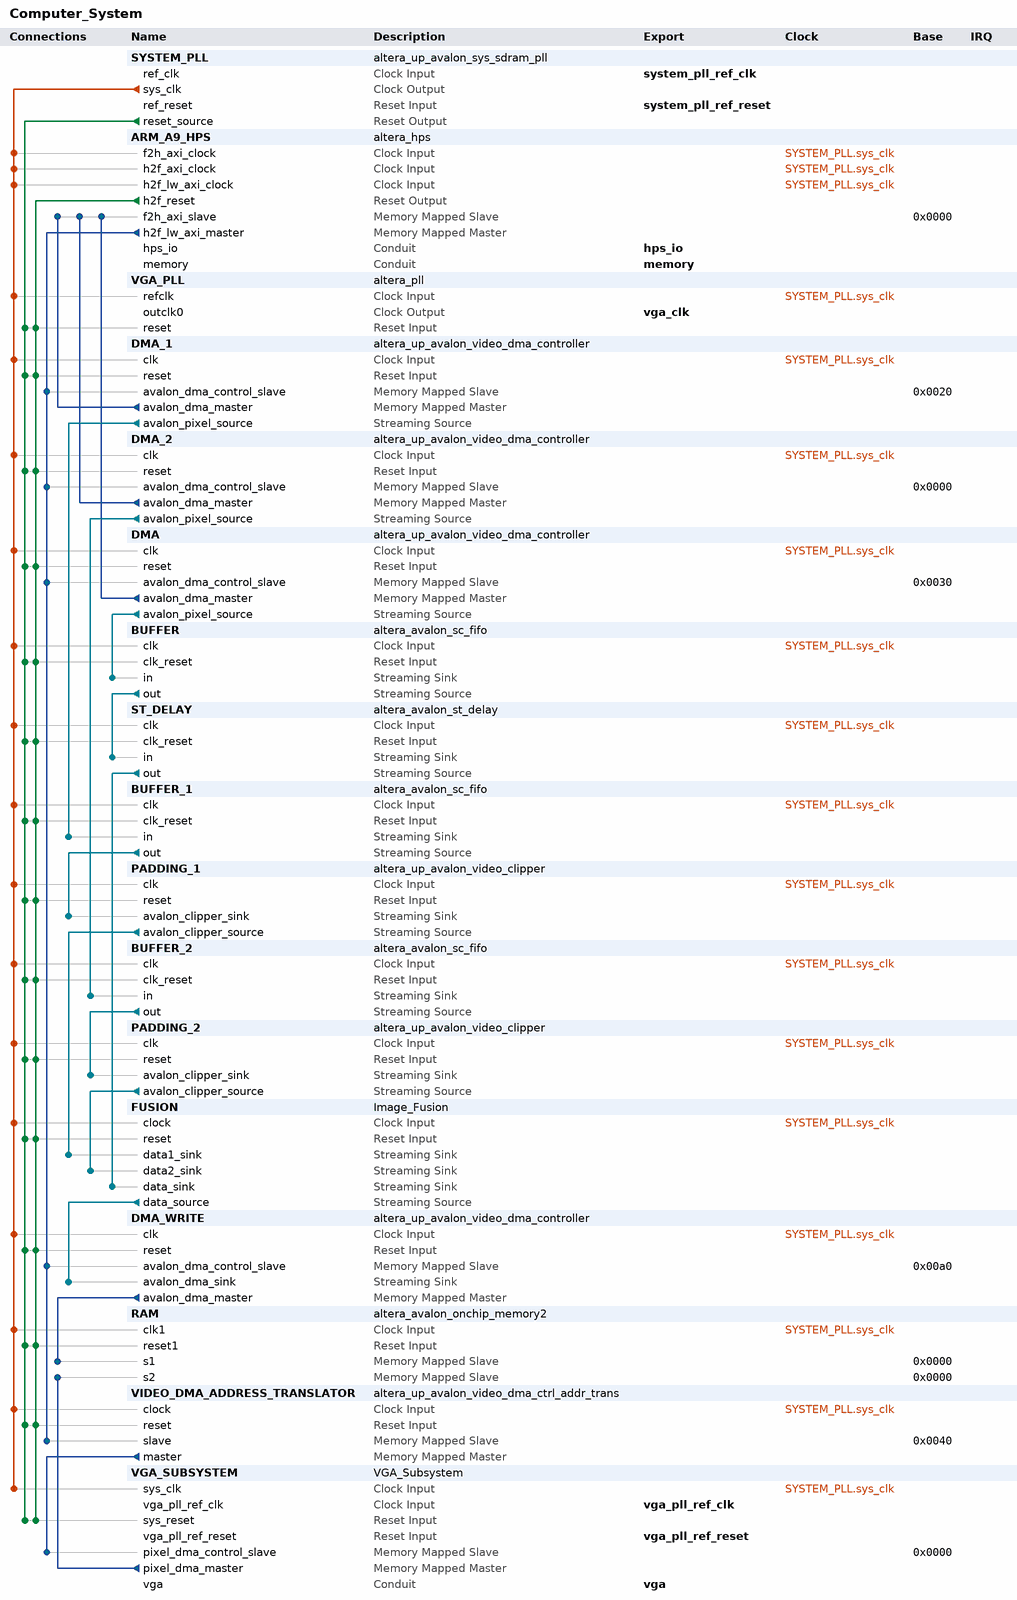
[diagram p0: system contents]
# Platform Designer (Qsys) system Computer_System, Cyclone V 5CSEMA5F31C6
# Parameters at their usual value, and those the tool derives, are not listed.
package require -exact qsys 17.1
create_system Computer_System
set_project_property DEVICE_FAMILY {Cyclone V}
set_project_property DEVICE 5CSEMA5F31C6

add_instance SYSTEM_PLL altera_up_avalon_sys_sdram_pll 17.1
set_instance_parameter_value SYSTEM_PLL CV_boards DE1-SoC
set_instance_parameter_value SYSTEM_PLL gui_outclk 100.0
set_instance_parameter_value SYSTEM_PLL gui_refclk 50.0

add_instance ARM_A9_HPS altera_hps 17.1
set_instance_parameter_value ARM_A9_HPS EMAC1_Mode RGMII
set_instance_parameter_value ARM_A9_HPS EMAC1_PinMuxing {HPS I/O Set 0}
set_instance_parameter_value ARM_A9_HPS F2SCLK_COLDRST_Enable false
set_instance_parameter_value ARM_A9_HPS F2SCLK_DBGRST_Enable false
set_instance_parameter_value ARM_A9_HPS F2SCLK_WARMRST_Enable false
set_instance_parameter_value ARM_A9_HPS F2SINTERRUPT_Enable true
set_instance_parameter_value ARM_A9_HPS F2S_Width 2
set_instance_parameter_value ARM_A9_HPS FPGA_PERIPHERAL_OUTPUT_CLOCK_FREQ_EMAC0_GTX_CLK 125
set_instance_parameter_value ARM_A9_HPS FPGA_PERIPHERAL_OUTPUT_CLOCK_FREQ_EMAC0_MD_CLK 2.5
set_instance_parameter_value ARM_A9_HPS FPGA_PERIPHERAL_OUTPUT_CLOCK_FREQ_EMAC1_GTX_CLK 125
set_instance_parameter_value ARM_A9_HPS FPGA_PERIPHERAL_OUTPUT_CLOCK_FREQ_EMAC1_MD_CLK 2.5
set_instance_parameter_value ARM_A9_HPS HPS_PROTOCOL DDR3
set_instance_parameter_value ARM_A9_HPS I2C0_Mode I2C
set_instance_parameter_value ARM_A9_HPS I2C0_PinMuxing {HPS I/O Set 0}
set_instance_parameter_value ARM_A9_HPS I2C1_Mode I2C
set_instance_parameter_value ARM_A9_HPS I2C1_PinMuxing {HPS I/O Set 0}
set_instance_parameter_value ARM_A9_HPS LWH2F_Enable true
set_instance_parameter_value ARM_A9_HPS MEM_BANKADDR_WIDTH 3
set_instance_parameter_value ARM_A9_HPS MEM_CLK_FREQ 400.0
set_instance_parameter_value ARM_A9_HPS MEM_COL_ADDR_WIDTH 10
set_instance_parameter_value ARM_A9_HPS MEM_DQ_WIDTH 32
set_instance_parameter_value ARM_A9_HPS MEM_DRV_STR RZQ/7
set_instance_parameter_value ARM_A9_HPS MEM_ROW_ADDR_WIDTH 15
set_instance_parameter_value ARM_A9_HPS MEM_RTT_NOM RZQ/4
set_instance_parameter_value ARM_A9_HPS MEM_RTT_WR RZQ/4
set_instance_parameter_value ARM_A9_HPS MEM_TCL 11
set_instance_parameter_value ARM_A9_HPS MEM_TFAW_NS 30.0
set_instance_parameter_value ARM_A9_HPS MEM_TRAS_NS 35.0
set_instance_parameter_value ARM_A9_HPS MEM_TRCD_NS 13.75
set_instance_parameter_value ARM_A9_HPS MEM_TRFC_NS 260.0
set_instance_parameter_value ARM_A9_HPS MEM_TRP_NS 13.75
set_instance_parameter_value ARM_A9_HPS MEM_VENDOR JEDEC
set_instance_parameter_value ARM_A9_HPS MEM_WTCL 8
set_instance_parameter_value ARM_A9_HPS QSPI_Mode {1 SS}
set_instance_parameter_value ARM_A9_HPS QSPI_PinMuxing {HPS I/O Set 0}
set_instance_parameter_value ARM_A9_HPS REF_CLK_FREQ 25.0
set_instance_parameter_value ARM_A9_HPS S2FCLK_USER2CLK 5
set_instance_parameter_value ARM_A9_HPS S2F_Width 3
set_instance_parameter_value ARM_A9_HPS SDIO_Mode {4-bit Data}
set_instance_parameter_value ARM_A9_HPS SDIO_PinMuxing {HPS I/O Set 0}
set_instance_parameter_value ARM_A9_HPS SPIM1_Mode {Single Slave Select}
set_instance_parameter_value ARM_A9_HPS SPIM1_PinMuxing {HPS I/O Set 0}
set_instance_parameter_value ARM_A9_HPS STM_Enable false
set_instance_parameter_value ARM_A9_HPS TIMING_BOARD_AC_SKEW 0.03
set_instance_parameter_value ARM_A9_HPS TIMING_BOARD_AC_TO_CK_SKEW 0.0
set_instance_parameter_value ARM_A9_HPS TIMING_BOARD_DQ_TO_DQS_SKEW 0.0
set_instance_parameter_value ARM_A9_HPS TIMING_BOARD_MAX_CK_DELAY 0.03
set_instance_parameter_value ARM_A9_HPS TIMING_BOARD_MAX_DQS_DELAY 0.02
set_instance_parameter_value ARM_A9_HPS TIMING_BOARD_SKEW_BETWEEN_DQS 0.08
set_instance_parameter_value ARM_A9_HPS TIMING_BOARD_SKEW_CKDQS_DIMM_MAX 0.16
set_instance_parameter_value ARM_A9_HPS TIMING_BOARD_SKEW_CKDQS_DIMM_MIN 0.09
set_instance_parameter_value ARM_A9_HPS TIMING_BOARD_SKEW_WITHIN_DQS 0.01
set_instance_parameter_value ARM_A9_HPS TIMING_TDH 65
set_instance_parameter_value ARM_A9_HPS TIMING_TDQSCK 255
set_instance_parameter_value ARM_A9_HPS TIMING_TDQSQ 125
set_instance_parameter_value ARM_A9_HPS TIMING_TDS 30
set_instance_parameter_value ARM_A9_HPS TIMING_TIH 140
set_instance_parameter_value ARM_A9_HPS TIMING_TIS 180
set_instance_parameter_value ARM_A9_HPS TIMING_TQSH 0.4
set_instance_parameter_value ARM_A9_HPS UART0_Mode {No Flow Control}
set_instance_parameter_value ARM_A9_HPS UART0_PinMuxing {HPS I/O Set 0}
set_instance_parameter_value ARM_A9_HPS USB1_Mode SDR
set_instance_parameter_value ARM_A9_HPS USB1_PinMuxing {HPS I/O Set 0}
set_instance_parameter_value ARM_A9_HPS desired_cfg_clk_mhz 100.0
set_instance_parameter_value ARM_A9_HPS desired_qspi_clk_mhz 400.0

add_instance VGA_PLL altera_pll 17.1
set_instance_parameter_value VGA_PLL gui_device_speed_grade 1
set_instance_parameter_value VGA_PLL gui_number_of_clocks 1
set_instance_parameter_value VGA_PLL gui_operation_mode normal
set_instance_parameter_value VGA_PLL gui_output_clock_frequency0 25.0
set_instance_parameter_value VGA_PLL gui_pll_mode {Integer-N PLL}
set_instance_parameter_value VGA_PLL gui_reference_clock_frequency 100.0
set_instance_parameter_value VGA_PLL gui_use_locked false

add_instance DMA_1 altera_up_avalon_video_dma_controller 17.1
set_instance_parameter_value DMA_1 addr_mode Consecutive
set_instance_parameter_value DMA_1 back_start_address 0
set_instance_parameter_value DMA_1 color_bits 8
set_instance_parameter_value DMA_1 color_planes 1
set_instance_parameter_value DMA_1 dma_enabled true
set_instance_parameter_value DMA_1 height 480
set_instance_parameter_value DMA_1 mode {From Memory to Stream}
set_instance_parameter_value DMA_1 start_address 0
set_instance_parameter_value DMA_1 width 640

add_instance DMA_2 altera_up_avalon_video_dma_controller 17.1
set_instance_parameter_value DMA_2 addr_mode Consecutive
set_instance_parameter_value DMA_2 back_start_address 0
set_instance_parameter_value DMA_2 color_bits 8
set_instance_parameter_value DMA_2 color_planes 1
set_instance_parameter_value DMA_2 dma_enabled true
set_instance_parameter_value DMA_2 height 480
set_instance_parameter_value DMA_2 mode {From Memory to Stream}
set_instance_parameter_value DMA_2 start_address 0
set_instance_parameter_value DMA_2 width 640

add_instance DMA altera_up_avalon_video_dma_controller 17.1
set_instance_parameter_value DMA addr_mode Consecutive
set_instance_parameter_value DMA back_start_address 0
set_instance_parameter_value DMA color_bits 8
set_instance_parameter_value DMA color_planes 1
set_instance_parameter_value DMA dma_enabled true
set_instance_parameter_value DMA height 480
set_instance_parameter_value DMA mode {From Memory to Stream}
set_instance_parameter_value DMA start_address 0
set_instance_parameter_value DMA width 640

add_instance BUFFER altera_avalon_sc_fifo 17.1
set_instance_parameter_value BUFFER BITS_PER_SYMBOL 8
set_instance_parameter_value BUFFER CHANNEL_WIDTH 0
set_instance_parameter_value BUFFER ERROR_WIDTH 0
set_instance_parameter_value BUFFER FIFO_DEPTH 8192
set_instance_parameter_value BUFFER USE_FILL_LEVEL 0
set_instance_parameter_value BUFFER USE_MEMORY_BLOCKS 1
set_instance_parameter_value BUFFER USE_PACKETS 1
set_instance_parameter_value BUFFER USE_STORE_FORWARD 0

add_instance ST_DELAY altera_avalon_st_delay 17.1
set_instance_parameter_value ST_DELAY BITS_PER_SYMBOL 8
set_instance_parameter_value ST_DELAY CHANNEL_WIDTH 1
set_instance_parameter_value ST_DELAY DATA_WIDTH 8
set_instance_parameter_value ST_DELAY ERROR_WIDTH 1
set_instance_parameter_value ST_DELAY MAX_CHANNELS 1
set_instance_parameter_value ST_DELAY NUMBER_OF_DELAY_CLOCKS 3
set_instance_parameter_value ST_DELAY USE_CHANNEL 0
set_instance_parameter_value ST_DELAY USE_ERROR 0
set_instance_parameter_value ST_DELAY USE_PACKETS 1

add_instance BUFFER_1 altera_avalon_sc_fifo 17.1
set_instance_parameter_value BUFFER_1 BITS_PER_SYMBOL 8
set_instance_parameter_value BUFFER_1 CHANNEL_WIDTH 0
set_instance_parameter_value BUFFER_1 ERROR_WIDTH 0
set_instance_parameter_value BUFFER_1 FIFO_DEPTH 8192
set_instance_parameter_value BUFFER_1 USE_FILL_LEVEL 0
set_instance_parameter_value BUFFER_1 USE_MEMORY_BLOCKS 1
set_instance_parameter_value BUFFER_1 USE_PACKETS 1
set_instance_parameter_value BUFFER_1 USE_STORE_FORWARD 0

add_instance PADDING_1 altera_up_avalon_video_clipper 17.1
set_instance_parameter_value PADDING_1 add_bottom 3
set_instance_parameter_value PADDING_1 add_left 3
set_instance_parameter_value PADDING_1 add_right 3
set_instance_parameter_value PADDING_1 add_top 3
set_instance_parameter_value PADDING_1 color_bits 8
set_instance_parameter_value PADDING_1 color_planes 1
set_instance_parameter_value PADDING_1 drop_bottom 0
set_instance_parameter_value PADDING_1 drop_left 0
set_instance_parameter_value PADDING_1 drop_right 0
set_instance_parameter_value PADDING_1 drop_top 0
set_instance_parameter_value PADDING_1 height_in 480
set_instance_parameter_value PADDING_1 width_in 640

add_instance BUFFER_2 altera_avalon_sc_fifo 17.1
set_instance_parameter_value BUFFER_2 BITS_PER_SYMBOL 8
set_instance_parameter_value BUFFER_2 CHANNEL_WIDTH 0
set_instance_parameter_value BUFFER_2 ERROR_WIDTH 0
set_instance_parameter_value BUFFER_2 FIFO_DEPTH 8192
set_instance_parameter_value BUFFER_2 USE_FILL_LEVEL 0
set_instance_parameter_value BUFFER_2 USE_MEMORY_BLOCKS 1
set_instance_parameter_value BUFFER_2 USE_PACKETS 1
set_instance_parameter_value BUFFER_2 USE_STORE_FORWARD 0

add_instance PADDING_2 altera_up_avalon_video_clipper 17.1
set_instance_parameter_value PADDING_2 add_bottom 3
set_instance_parameter_value PADDING_2 add_left 3
set_instance_parameter_value PADDING_2 add_right 3
set_instance_parameter_value PADDING_2 add_top 3
set_instance_parameter_value PADDING_2 color_bits 8
set_instance_parameter_value PADDING_2 color_planes 1
set_instance_parameter_value PADDING_2 drop_bottom 0
set_instance_parameter_value PADDING_2 drop_left 0
set_instance_parameter_value PADDING_2 drop_right 0
set_instance_parameter_value PADDING_2 drop_top 0
set_instance_parameter_value PADDING_2 height_in 480
set_instance_parameter_value PADDING_2 width_in 640

add_instance FUSION Image_Fusion 1.0

add_instance DMA_WRITE altera_up_avalon_video_dma_controller 17.1
set_instance_parameter_value DMA_WRITE addr_mode Consecutive
set_instance_parameter_value DMA_WRITE back_start_address 0
set_instance_parameter_value DMA_WRITE color_bits 8
set_instance_parameter_value DMA_WRITE color_planes 1
set_instance_parameter_value DMA_WRITE dma_enabled true
set_instance_parameter_value DMA_WRITE height 480
set_instance_parameter_value DMA_WRITE mode {From Stream to Memory}
set_instance_parameter_value DMA_WRITE start_address 0
set_instance_parameter_value DMA_WRITE width 640

add_instance RAM altera_avalon_onchip_memory2 17.1
set_instance_parameter_value RAM dataWidth 8
set_instance_parameter_value RAM dualPort true
set_instance_parameter_value RAM initMemContent false
set_instance_parameter_value RAM initializationFileName onchip_mem.hex
set_instance_parameter_value RAM memorySize 307200
set_instance_parameter_value RAM singleClockOperation true

add_instance VIDEO_DMA_ADDRESS_TRANSLATOR altera_up_avalon_video_dma_ctrl_addr_trans 17.1

add_instance VGA_SUBSYSTEM VGA_Subsystem 1.0

# connections
add_connection SYSTEM_PLL.sys_clk ARM_A9_HPS.f2h_axi_clock clock
add_connection SYSTEM_PLL.sys_clk ARM_A9_HPS.h2f_axi_clock clock
add_connection SYSTEM_PLL.sys_clk ARM_A9_HPS.h2f_lw_axi_clock clock
add_connection SYSTEM_PLL.sys_clk BUFFER.clk clock
add_connection SYSTEM_PLL.sys_clk BUFFER_1.clk clock
add_connection SYSTEM_PLL.sys_clk BUFFER_2.clk clock
add_connection SYSTEM_PLL.sys_clk DMA.clk clock
add_connection SYSTEM_PLL.sys_clk DMA_1.clk clock
add_connection SYSTEM_PLL.sys_clk DMA_2.clk clock
add_connection SYSTEM_PLL.sys_clk DMA_WRITE.clk clock
add_connection SYSTEM_PLL.sys_clk FUSION.clock clock
add_connection SYSTEM_PLL.sys_clk PADDING_1.clk clock
add_connection SYSTEM_PLL.sys_clk PADDING_2.clk clock
add_connection SYSTEM_PLL.sys_clk RAM.clk1 clock
add_connection SYSTEM_PLL.sys_clk ST_DELAY.clk clock
add_connection SYSTEM_PLL.sys_clk VGA_PLL.refclk clock
add_connection SYSTEM_PLL.sys_clk VGA_SUBSYSTEM.sys_clk clock
add_connection SYSTEM_PLL.sys_clk VIDEO_DMA_ADDRESS_TRANSLATOR.clock clock
add_connection ARM_A9_HPS.h2f_reset BUFFER.clk_reset reset
add_connection ARM_A9_HPS.h2f_reset BUFFER_1.clk_reset reset
add_connection ARM_A9_HPS.h2f_reset BUFFER_2.clk_reset reset
add_connection ARM_A9_HPS.h2f_reset DMA.reset reset
add_connection ARM_A9_HPS.h2f_reset DMA_1.reset reset
add_connection ARM_A9_HPS.h2f_reset DMA_2.reset reset
add_connection ARM_A9_HPS.h2f_reset DMA_WRITE.reset reset
add_connection ARM_A9_HPS.h2f_reset FUSION.reset reset
add_connection ARM_A9_HPS.h2f_reset PADDING_1.reset reset
add_connection ARM_A9_HPS.h2f_reset PADDING_2.reset reset
add_connection ARM_A9_HPS.h2f_reset RAM.reset1 reset
add_connection ARM_A9_HPS.h2f_reset ST_DELAY.clk_reset reset
add_connection ARM_A9_HPS.h2f_reset VGA_PLL.reset reset
add_connection ARM_A9_HPS.h2f_reset VGA_SUBSYSTEM.sys_reset reset
add_connection ARM_A9_HPS.h2f_reset VIDEO_DMA_ADDRESS_TRANSLATOR.reset reset
add_connection SYSTEM_PLL.reset_source BUFFER.clk_reset reset
add_connection SYSTEM_PLL.reset_source BUFFER_1.clk_reset reset
add_connection SYSTEM_PLL.reset_source BUFFER_2.clk_reset reset
add_connection SYSTEM_PLL.reset_source DMA.reset reset
add_connection SYSTEM_PLL.reset_source DMA_1.reset reset
add_connection SYSTEM_PLL.reset_source DMA_2.reset reset
add_connection SYSTEM_PLL.reset_source DMA_WRITE.reset reset
add_connection SYSTEM_PLL.reset_source FUSION.reset reset
add_connection SYSTEM_PLL.reset_source PADDING_1.reset reset
add_connection SYSTEM_PLL.reset_source PADDING_2.reset reset
add_connection SYSTEM_PLL.reset_source RAM.reset1 reset
add_connection SYSTEM_PLL.reset_source ST_DELAY.clk_reset reset
add_connection SYSTEM_PLL.reset_source VGA_PLL.reset reset
add_connection SYSTEM_PLL.reset_source VGA_SUBSYSTEM.sys_reset reset
add_connection SYSTEM_PLL.reset_source VIDEO_DMA_ADDRESS_TRANSLATOR.reset reset
add_connection ARM_A9_HPS.h2f_lw_axi_master DMA.avalon_dma_control_slave avalon
set_connection_parameter_value ARM_A9_HPS.h2f_lw_axi_master/DMA.avalon_dma_control_slave baseAddress 0x0030
add_connection ARM_A9_HPS.h2f_lw_axi_master DMA_1.avalon_dma_control_slave avalon
set_connection_parameter_value ARM_A9_HPS.h2f_lw_axi_master/DMA_1.avalon_dma_control_slave baseAddress 0x0020
add_connection ARM_A9_HPS.h2f_lw_axi_master DMA_2.avalon_dma_control_slave avalon
set_connection_parameter_value ARM_A9_HPS.h2f_lw_axi_master/DMA_2.avalon_dma_control_slave baseAddress 0x0000
add_connection ARM_A9_HPS.h2f_lw_axi_master DMA_WRITE.avalon_dma_control_slave avalon
set_connection_parameter_value ARM_A9_HPS.h2f_lw_axi_master/DMA_WRITE.avalon_dma_control_slave baseAddress 0x00a0
add_connection ARM_A9_HPS.h2f_lw_axi_master VIDEO_DMA_ADDRESS_TRANSLATOR.slave avalon
set_connection_parameter_value ARM_A9_HPS.h2f_lw_axi_master/VIDEO_DMA_ADDRESS_TRANSLATOR.slave baseAddress 0x0040
add_connection DMA.avalon_dma_master ARM_A9_HPS.f2h_axi_slave avalon
set_connection_parameter_value DMA.avalon_dma_master/ARM_A9_HPS.f2h_axi_slave baseAddress 0x0000
add_connection DMA_1.avalon_dma_master ARM_A9_HPS.f2h_axi_slave avalon
set_connection_parameter_value DMA_1.avalon_dma_master/ARM_A9_HPS.f2h_axi_slave baseAddress 0x0000
add_connection DMA_2.avalon_dma_master ARM_A9_HPS.f2h_axi_slave avalon
set_connection_parameter_value DMA_2.avalon_dma_master/ARM_A9_HPS.f2h_axi_slave baseAddress 0x0000
add_connection DMA_WRITE.avalon_dma_master RAM.s1 avalon
set_connection_parameter_value DMA_WRITE.avalon_dma_master/RAM.s1 baseAddress 0x0000
add_connection VGA_SUBSYSTEM.pixel_dma_master RAM.s2 avalon
set_connection_parameter_value VGA_SUBSYSTEM.pixel_dma_master/RAM.s2 baseAddress 0x0000
add_connection VIDEO_DMA_ADDRESS_TRANSLATOR.master VGA_SUBSYSTEM.pixel_dma_control_slave avalon
set_connection_parameter_value VIDEO_DMA_ADDRESS_TRANSLATOR.master/VGA_SUBSYSTEM.pixel_dma_control_slave baseAddress 0x0000
add_connection BUFFER.out ST_DELAY.in avalon_streaming
add_connection BUFFER_1.out PADDING_1.avalon_clipper_sink avalon_streaming
add_connection BUFFER_2.out PADDING_2.avalon_clipper_sink avalon_streaming
add_connection DMA.avalon_pixel_source BUFFER.in avalon_streaming
add_connection DMA_1.avalon_pixel_source BUFFER_1.in avalon_streaming
add_connection DMA_2.avalon_pixel_source BUFFER_2.in avalon_streaming
add_connection FUSION.data_source DMA_WRITE.avalon_dma_sink avalon_streaming
add_connection PADDING_1.avalon_clipper_source FUSION.data1_sink avalon_streaming
add_connection PADDING_2.avalon_clipper_source FUSION.data2_sink avalon_streaming
add_connection ST_DELAY.out FUSION.data_sink avalon_streaming

# exported interfaces
add_interface hps_io conduit end
set_interface_property hps_io EXPORT_OF ARM_A9_HPS.hps_io
add_interface memory conduit end
set_interface_property memory EXPORT_OF ARM_A9_HPS.memory
add_interface system_pll_ref_clk clock sink
set_interface_property system_pll_ref_clk EXPORT_OF SYSTEM_PLL.ref_clk
add_interface system_pll_ref_reset reset sink
set_interface_property system_pll_ref_reset EXPORT_OF SYSTEM_PLL.ref_reset
add_interface vga conduit end
set_interface_property vga EXPORT_OF VGA_SUBSYSTEM.vga
add_interface vga_clk clock source
set_interface_property vga_clk EXPORT_OF VGA_PLL.outclk0
add_interface vga_pll_ref_clk clock sink
set_interface_property vga_pll_ref_clk EXPORT_OF VGA_SUBSYSTEM.vga_pll_ref_clk
add_interface vga_pll_ref_reset reset sink
set_interface_property vga_pll_ref_reset EXPORT_OF VGA_SUBSYSTEM.vga_pll_ref_reset

set_interconnect_requirement {$system} qsys_mm.clockCrossingAdapter HANDSHAKE
set_interconnect_requirement {$system} qsys_mm.maxAdditionalLatency 1

save_system Computer_System.qsys
